# Altium schematic sheet Sheet1.SchDoc
size A; SheetNumber: 1; SheetTotal: 1
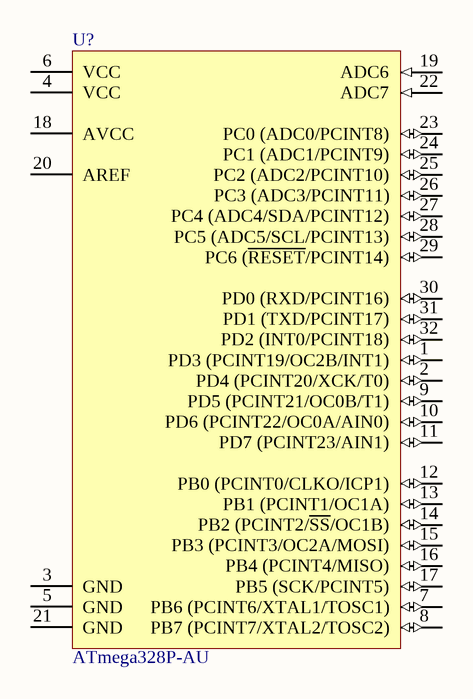
[diagram p0: Sheet1.SchDoc]

## Parts
U?  ATmega328P-AU  [32A_M]

## Nets

Not connected (* = marked no-connect by the designer): U? 1(PD3_(PCINT19/OC2B/INT1)) 2(PD4_(PCINT20/XCK/T0)) 3(GND) 4(VCC) 5(GND) 6(VCC) 7(PB6_(PCINT6/XTAL1/TOSC1)) 8(PB7_(PCINT7/XTAL2/TOSC2)) 9(PD5_(PCINT21/OC0B/T1)) 10(PD6_(PCINT22/OC0A/AIN0)) 11(PD7_(PCINT23/AIN1)) 12(PB0_(PCINT0/CLKO/ICP1)) 13(PB1_(PCINT1/OC1A)) 14(PB2_(PCINT2/~{SS}/OC1B)) 15(PB3_(PCINT3/OC2A/MOSI)) 16(PB4_(PCINT4/MISO)) 17(PB5_(SCK/PCINT5)) 18(AVCC) 19(ADC6) 20(AREF) 21(GND) 22(ADC7) 23(PC0_(ADC0/PCINT8)) 24(PC1_(ADC1/PCINT9)) 25(PC2_(ADC2/PCINT10)) 26(PC3_(ADC3/PCINT11)) 27(PC4_(ADC4/SDA/PCINT12)) 28(PC5_(ADC5/SCL/PCINT13)) 29(PC6_(~{RESET}/PCINT14)) 30(PD0_(RXD/PCINT16)) 31(PD1_(TXD/PCINT17)) 32(PD2_(INT0/PCINT18))

## Library data of the parts
U? = CMP-0095-00269-2: 8-bit AVR Microcontroller, 32KB Flash, 1KB EEPROM, 2KB SRAM, 32-pin TQFP, Industrial Grade (-40°C to 85°C); PackageDescription: 32-Lead, 7x7x1.0 mm Body, 0.8mm Lead Pitch, Thin Profile Plastic Quad Flat Package (TQFP); DatasheetVersion: revD, May-2011; RevisionNote: DatasheetVersion & PackageVersion updated. URLs added.; ComponentLink1URL: http://www.atmel.com/; ComponentLink2Description: ATmega48A/48PA/88A/88PA/168A/168PA/328/328P Datasheet; Code_JEDEC: MS-026-ABA; ComponentLink1Description: Manufacturer URL; PackageReference: 32A; ComponentLink3Description: ATmega48A/48PA/88A/88PA/168A/168PA/328/328P Summary; ComponentLink2URL: http://www.atmel.com/dyn/resources/prod_documents/doc8271.pdf; PackageVersion: revC, Oct-2010; ComponentLink3URL: http://www.atmel.com/dyn/resources/prod_documents/8271S.pdf